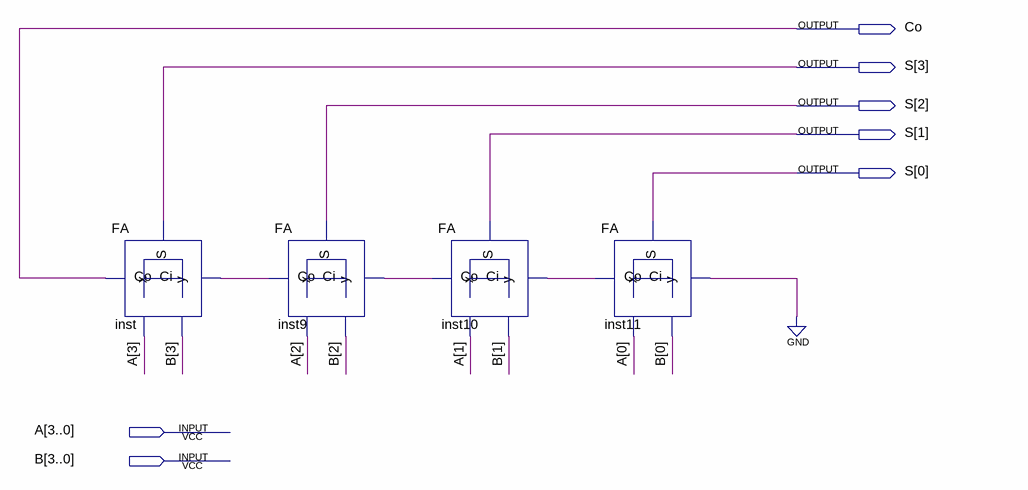
[diagram p0: schematic sheet]
// Quartus schematic FA4.bdf as structural Verilog: 4 symbols, 7 pins
module FA4 (
  input  [3:0] A,
  input  [3:0] B,
  output Co,
  output [3:0] S
);

  wire inst9_co, inst10_co, inst11_co;

  FA inst (.Ci(inst9_co), .x(A[3]), .y(B[3]), .Co(Co), .S(S[3]));
  FA inst9 (.Ci(inst10_co), .x(A[2]), .y(B[2]), .Co(inst9_co), .S(S[2]));
  FA inst10 (.Ci(inst11_co), .x(A[1]), .y(B[1]), .Co(inst10_co), .S(S[1]));
  FA inst11 (.Ci(1'b0), .x(A[0]), .y(B[0]), .Co(inst11_co), .S(S[0]));
endmodule
